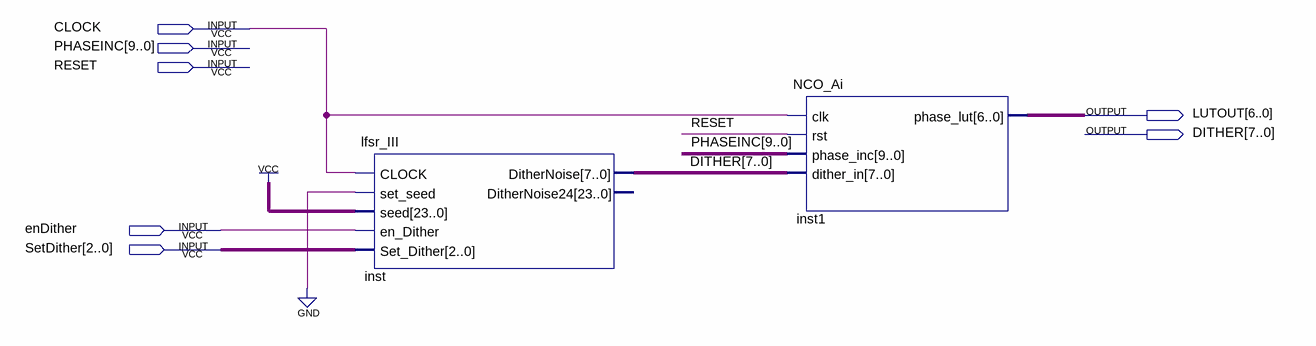
[diagram p0: schematic sheet]
// Quartus schematic NCOandDIther.bdf as structural Verilog: 2 symbols, 7 pins
module NCOandDIther (
  input  CLOCK,
  input  [9:0] PHASEINC,
  input  RESET,
  input  enDither,
  input  [2:0] SetDither,
  output [6:0] LUTOUT,
  output [7:0] DITHER
);

  lfsr_III inst (
    .CLOCK(CLOCK), .set_seed(1'b0), .seed({24{1'b1}}), .en_Dither(enDither), .Set_Dither(SetDither),
    .DitherNoise(DITHER));  // open: DitherNoise24
  NCO_Ai inst1 (.clk(CLOCK), .rst(RESET), .phase_inc(PHASEINC), .dither_in(DITHER), .phase_lut(LUTOUT));
endmodule
